# Altium schematic sheet BSPD_Main.SchDoc: BSPD: Main
size A4; Author: Pol Feliu; DrawnBy: Pol Feliu; DocumentNumber: 1; Revision: 1; SheetNumber: 1; SheetTotal: 4; University: UPC EEBE; City: Barcelona; Country: Spain; CP: 08019; Address: Av. Eduard Maristany, 16
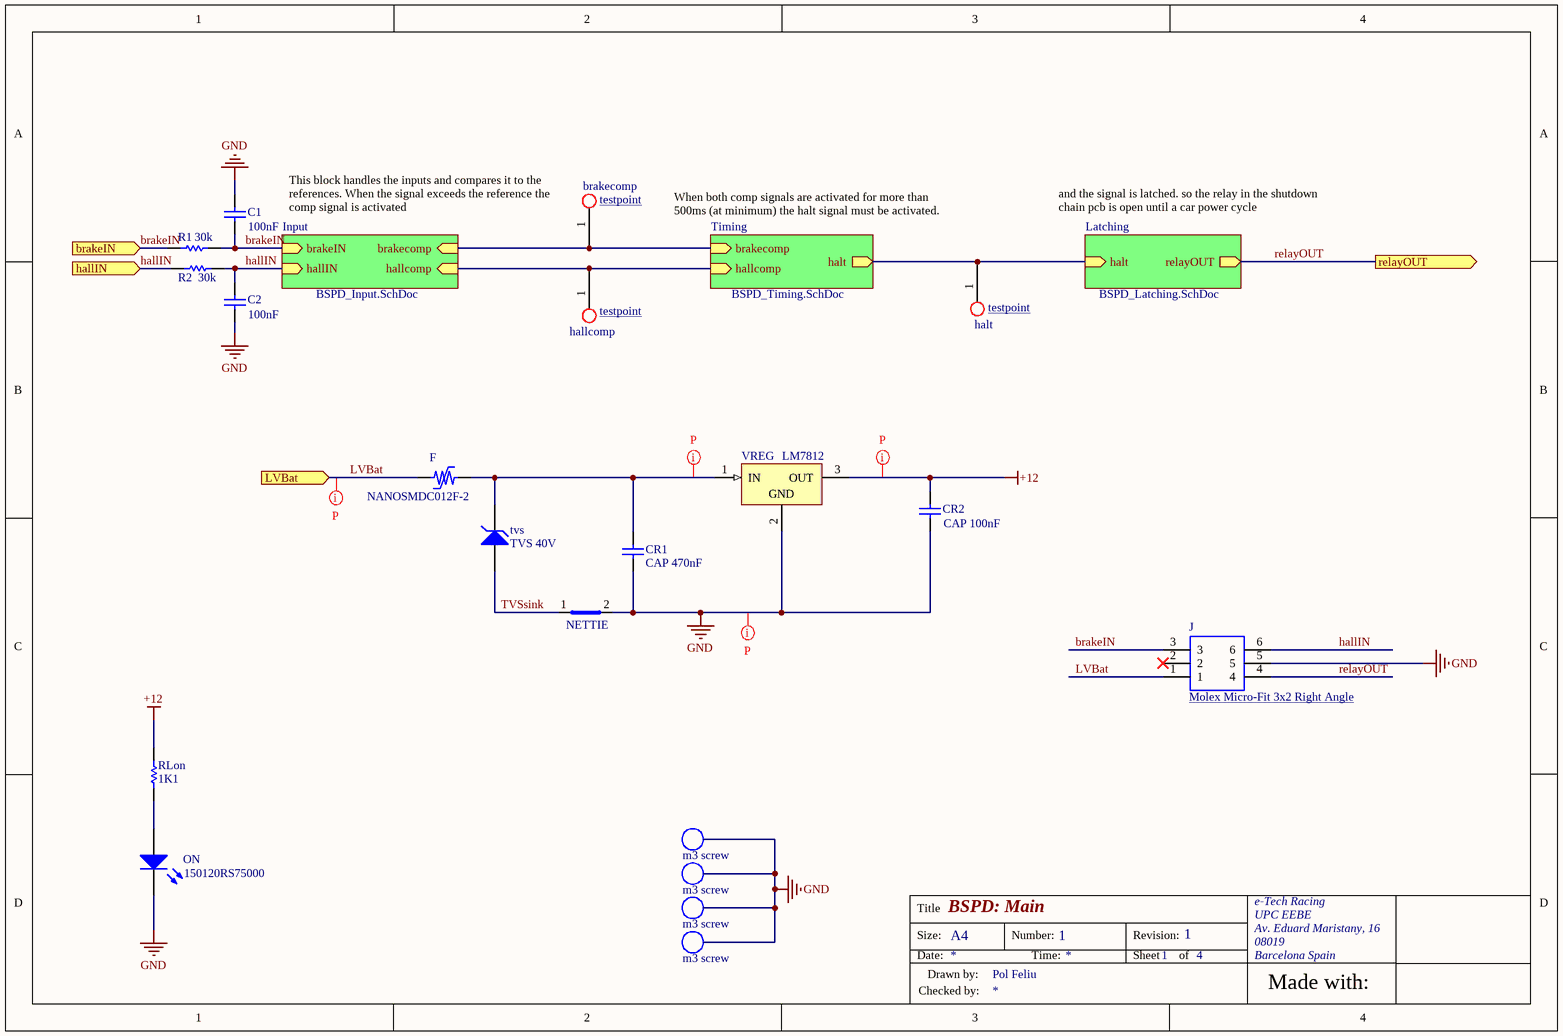
[diagram p0: BSPD_Main.SchDoc]

## Parts
brakecomp  testpoint  [testpoint]
C1  100nF  [CAPC0805(2012)145_M]
C2  100nF  [CAPC0805(2012)145_M]
CR1  CAP 470nF  [CAPC0805(2012)110_M]
CR2  CAP 100nF  [CAPC0805(2012)145_M]
F  NANOSMDC012F-2  [TECO-NANOSMDC012F_V]
hallcomp  testpoint  [testpoint]
halt  testpoint  [testpoint]
J  Molex Micro-Fit 3x2 Right Angle  [Molex Micro-fit 3x2 Right angle]
m3screw1  m3 screw  [M3 screw]
m3screw2  m3 screw  [M3 screw]
m3screw3  m3 screw  [M3 screw]
m3screw4  m3 screw  [M3 screw]
nettie  NETTIE  [NETTIE-SMT2-W0.8L2.0(MM)]  (net tie, no BOM)
ON  150120RS75000  [1206_A]
R1  30k  [RESC3216X60X45LL10T20]
R2  30k  [RESC3216X60X45LL10T20]
RLon  1K1  [RESC1206(3216)_M]
tvs  TVS 40V  [TVS  DO-214AB]
VREG  LM7812  [FAIR-TO-220-3]

## Sub-sheets
Input = BSPD_Input.SchDoc: brakecomp (in), brakeIN (in), hallIN (in), hallcomp (in)
Latching = BSPD_Latching.SchDoc: halt (in), relayOUT (out)
Timing = BSPD_Timing.SchDoc: brakecomp (in), hallcomp (in), halt (out)

## Ports
brakeIN (in), hallIN (in), LVBat (in), relayOUT (out)

## Nets
+12: CR2.2 RLon.2 VREG.3(OUT)
GND: C1.2 C2.1 CR1.1 CR2.1 J.5 m3screw1.pad m3screw2.pad m3screw3.pad m3screw4.pad nettie.2(Net2) ON.1(K) VREG.2(GND)
brakeIN: C1.1 J.3 R1.1 R1.2 ; port brakeIN, sheet Input/brakeIN
hallIN: C2.2 J.6 R2.1 R2.2 ; port hallIN, sheet Input/hallIN
LVBat: F.1 J.1 ; port LVBat
relayOUT: J.4 ; port relayOUT, sheet Latching/relayOUT
TVSsink: nettie.1(Net1) tvs.2(A)
Netbrakecomp_1: brakecomp.1 ; sheet Input/brakecomp, sheet Timing/brakecomp
NetCR1_2: CR1.2 F.2 tvs.1(K) VREG.1(IN)
Nethallcomp_1: hallcomp.1 ; sheet Input/hallcomp, sheet Timing/hallcomp
Nethalt_1: halt.1 ; sheet Timing/halt, sheet Latching/halt
NetON_2: ON.2(A) RLon.1

Not connected (* = marked no-connect by the designer): J 2*

## Layout directives
net class power: +12, GND, LVBat, NetCR1_2

## Notes on the sheet
- (near brakecomp) This block handles the inputs and compares it to the references. When the signal exceeds the reference the comp signal is activated
- When both comp signals are activated for more than 500ms (at minimum) the halt signal must be activated.
- and the signal is latched. so the relay in the shutdown chain pcb is open until a car power cycle
- Title
- e-Tech Racing
- UPC EEBE
- Size:
- Date:
- Drawn by:
- A4
- Number:
- Time:
- Revision:
- Sheet
- of
- Av. Eduard Maristany, 16
- 08019
- Barcelona Spain
- Made with:
- Checked by:

## Library data of the parts
C1 C2 CR2 = CMP-1036-04417-1: CAP 100nF 50V ±5% 0805 (2012 Metric) Thickness 1.45mm SMD; Case-Metric: 2012; Tolerance: Â±5%; Case-EIA: 0805; Max Thickness: 1.45 mm; Rated Voltage: 50 V; Value: 100nF; Technology: SMT
CR1 = CMP-1036-04655-1: CAP 470nF 50V ±20% 0805 (2012 Metric) Thickness 1.1mm SMD; Case-Metric: 2012; Case-EIA: 0805; Tolerance: Â±20%; Max Thickness: 1.1 mm; Value: 470nF; Technology: SMT; Rated Voltage: 50 V
F = CMP-2000-06803-1: PolySwitch Resettable Device, 0.12 A, 48 V, -40 to 85 degC, 2-Pin SMD, RoHS, Tape and Reel; Manufacturer: TEConnectivity/CircuitProtection; Hold Current: 0.12A; Trip Current: 0.39A; Minimum Initial Resistance: 1.4Ohm; Lead Diameter: N/R; Agency Approvals: CSA/TUV/UL; Maximum Trip Time: 0.2@1As; Typical Power Dissipation: 0.5(Max)W; Maximum Current Rating: 10A; Maximum Post Trip Resistance: 6.5Ohm; Maximum Voltage Rating: 48VDC; Package Reference: NANOSMDC012F; Mounting: SurfaceMount; Mounting Technology: SurfaceMount; Maximum Initial Resistance: N/A; Number of Terminals: 2; Applications: N/A; Datasheet URL: http://www.te.com/commerce/DocumentDelivery/DDEController?Action=srchrtrv&DocNm=CLP00010&DocType=CS&DocLang=English; Seated Plane Height: N/R; Operating Temperature: -40to85C; Family: nanoSMD; Packaging: TapeandReel; Dimension: 3.4(Max)x1.8(Max)x1(Max)mm; Terminal Pitch: N/R; Package/Case: 1206; Wire Form: N/R; Manufacturer URL: http://www.te.com/; Datasheet Version: 11/2013; RoHS: Yes; Part No: NANOSMDC012F-2; Package Description: 2-Pin Surface Mount Device, Body 3.2 x 1.585 mm
J = Molex Micro-Fit 3x2 Right Angle: 43045-0600; ComponentLink1Description: Molex; ComponentLink1URL: https://www.molex.com/molex/products/datasheet.jsp?part=active/0430450600_PCB_HEADERS.xml; ComponentLink2Description: Datasheet; ComponentLink2URL: https://www.molex.com/pdm_docs/sd/430450600_sd.pdf
nettie = CMP-0488-00002-1: Net-Tie, Surface Mount, 2.0 mm x 0.8 mm, 2 Pads (1.2 mm x 0.8 mm)
ON = CMP-1426-00013-1: SMD mono-color Chip LED, WL-SMCW, Red; Manufacturer: Wuerth Elektronik; Color: Red; ComponentLink2URL: http://katalog.we-online.com/led/datasheet/150120RS75000.pdf; ComponentLink2Description: Datasheet; ComponentLink1Description: Manufacturer URL; ComponentLink1URL: http://www.we-online.com; PartNumber: 150120RS75000; PackageReference: 1206_A
R1 = CMP-2003-02083-1: Manufacturer: Vishay Dale; Part Number: CRCW120630K0JNEA
R2 = CMP-2003-02083-1: CRCW120630K0JNEA; Manufacturer: Vishay Dale; Part Number: CRCW120630K0JNEA
RLon = CMP-1014-00075-1: 1K1 0.25W 5% 1206 (3216 Metric)  SMD; Case-EIA: 1206; Value: 1100.00 Ohm; Case-Metric: 3216; Technology: SMT; Power: 0.25 W; Tolerance: 5 %
tvs = TVS 40V: WURTH ELEKTRONIK         824551401             TVS Diode, WE-TVSP Series, Bidirectional, 40 V, 64.5 V, DO-214AB, 2 Pins; Manufacturer: Wurth Electronics; Number of Bidirectional Channels: 1; Min Breakdown Voltage: 46.75V; Clamping Voltage: 64.5V; Peak Pulse Power: 3kW; Power Line Protection: No; Peak Pulse Current: 46.5A; Manufacturer Part Number: 824551401; Mount: Surface Mount; Number of Pins: 2; Min Operating Temperature: -65°C; Max Operating Temperature: 150°C; Packaging: Cut Tape; Reverse Standoff Voltage: 40V; Polarity: Bidirectional; Max Breakdown Voltage: 46.75V; Composition: Zener; REACH SVHC: Unknown; Supplier Part Number 1: 824551401; Supplier 1: Wurth Patro
VREG = CMP-2000-04938-1: Positive Voltage Regulator, 5 V, 1 A, -40 to 125 degC, 3-Pin TO-220, RoHS, Tube; Manufacturer: FairchildSemiconductor; Maximum Input Voltage: 35V; Maximum Quiescent Current: 8mA; Load Regulation: 100mV; Maximum Output Current: 2.2(Typ)A; Output Type: Fixed; Typical Dropout Voltage @ Current: 2@1AV; Rad Hard: No; Output Voltage: 5V; Accuracy: ±4%; Number of Outputs: 1; Category: LinearRegulator; Package Description: 3-Pin Through Hole Device, Body 10 x 4.5 mm, Pitch 2.54 mm; Packaging: Rail/Tube; Mounting: ThroughHole; Polarity: Positive; Manufacturer URL: https://www.fairchildsemi.com/; Line Regulation: 100mV; Datasheet Version: Aug-12; Datasheet URL: https://datasheet.ciiva.com/26904/lm7805ct-26904988.pdf; Package Reference: TO-220; Package URL: https://www.fairchildsemi.com/package-drawings/TO/TO220B03.pdf; Package: 3TO-220AB; Operating Temperature: -40to125degC; Type: Linear